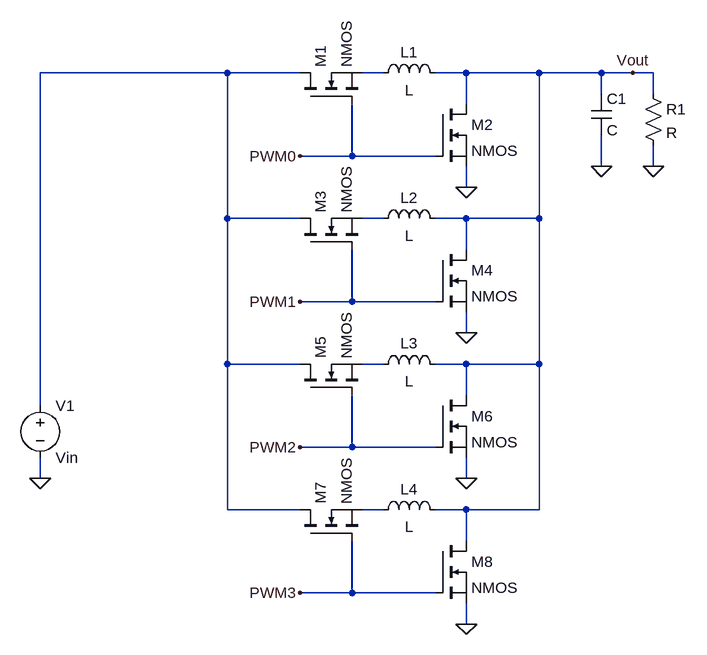
[diagram p0: schematic basic_diagram.asc]
basic_diagram.asc, the LTspice schematic file:
Version 4
SHEET 1 880 836
WIRE -16 -32 -304 -32
WIRE 96 -32 -16 -32
WIRE 224 -32 192 -32
WIRE 352 -32 304 -32
WIRE 464 -32 352 -32
WIRE 560 -32 464 -32
WIRE 608 -32 560 -32
WIRE 640 -32 608 -32
WIRE 560 0 560 -32
WIRE 640 0 640 -32
WIRE 352 16 352 -32
WIRE 176 96 176 16
WIRE 176 96 96 96
WIRE 304 96 176 96
WIRE 560 112 560 64
WIRE 640 112 640 80
WIRE 352 144 352 112
WIRE -16 192 -16 -32
WIRE 96 192 -16 192
WIRE 224 192 192 192
WIRE 352 192 304 192
WIRE 464 192 464 -32
WIRE 464 192 352 192
WIRE 352 240 352 192
WIRE 176 320 176 240
WIRE 176 320 96 320
WIRE 304 320 176 320
WIRE 352 368 352 336
WIRE -16 416 -16 192
WIRE 96 416 -16 416
WIRE 224 416 192 416
WIRE 352 416 304 416
WIRE 464 416 464 192
WIRE 464 416 352 416
WIRE 352 464 352 416
WIRE -304 480 -304 -32
WIRE 176 544 176 464
WIRE 176 544 96 544
WIRE 304 544 176 544
WIRE -304 592 -304 560
WIRE 352 592 352 560
WIRE -16 640 -16 416
WIRE 96 640 -16 640
WIRE 224 640 192 640
WIRE 352 640 304 640
WIRE 464 640 464 416
WIRE 464 640 352 640
WIRE 352 688 352 640
WIRE 176 768 176 688
WIRE 176 768 96 768
WIRE 304 768 176 768
WIRE 352 816 352 784
FLAG 352 144 0
FLAG 352 368 0
FLAG 352 592 0
FLAG 352 816 0
FLAG -304 592 0
FLAG 560 112 0
FLAG 640 112 0
FLAG 96 96 PWM0
FLAG 96 320 PWM1
FLAG 96 544 PWM2
FLAG 96 768 PWM3
FLAG 608 -32 Vout
SYMBOL nmos 96 16 R270
SYMATTR InstName M1
SYMBOL nmos 304 16 R0
SYMATTR InstName M2
SYMBOL ind 208 -16 R270
WINDOW 0 32 56 VTop 2
WINDOW 3 5 56 VBottom 2
SYMATTR InstName L1
SYMBOL nmos 96 240 R270
SYMATTR InstName M3
SYMBOL nmos 304 240 R0
SYMATTR InstName M4
SYMBOL ind 208 208 R270
WINDOW 0 32 56 VTop 2
WINDOW 3 5 56 VBottom 2
SYMATTR InstName L2
SYMBOL nmos 96 464 R270
SYMATTR InstName M5
SYMBOL nmos 304 464 R0
SYMATTR InstName M6
SYMBOL ind 208 432 R270
WINDOW 0 32 56 VTop 2
WINDOW 3 5 56 VBottom 2
SYMATTR InstName L3
SYMBOL nmos 96 688 R270
SYMATTR InstName M7
SYMBOL nmos 304 688 R0
SYMATTR InstName M8
SYMBOL ind 208 656 R270
WINDOW 0 32 56 VTop 2
WINDOW 3 5 56 VBottom 2
SYMATTR InstName L4
SYMBOL voltage -304 464 R0
SYMATTR InstName V1
SYMATTR Value Vin
SYMBOL cap 544 0 R0
SYMATTR InstName C1
SYMBOL res 624 -16 R0
SYMATTR InstName R1

The netlist it stands for:
* basic_diagram.asc
M1 N001 PWM0 N002 N002 NMOS
M2 Vout PWM0 0 0 NMOS
L1 N002 Vout L
M3 N001 PWM1 N003 N003 NMOS
M4 Vout PWM1 0 0 NMOS
L2 N003 Vout L
M5 N001 PWM2 N004 N004 NMOS
M6 Vout PWM2 0 0 NMOS
L3 N004 Vout L
M7 N001 PWM3 N005 N005 NMOS
M8 Vout PWM3 0 0 NMOS
L4 N005 Vout L
V1 N001 0 Vin
C1 Vout 0 C
R1 Vout 0 R
.model NMOS NMOS
.model PMOS PMOS
.lib standard.mos
.backanno
.end